# Altium schematic sheet TestPoints.SchDoc
size A4
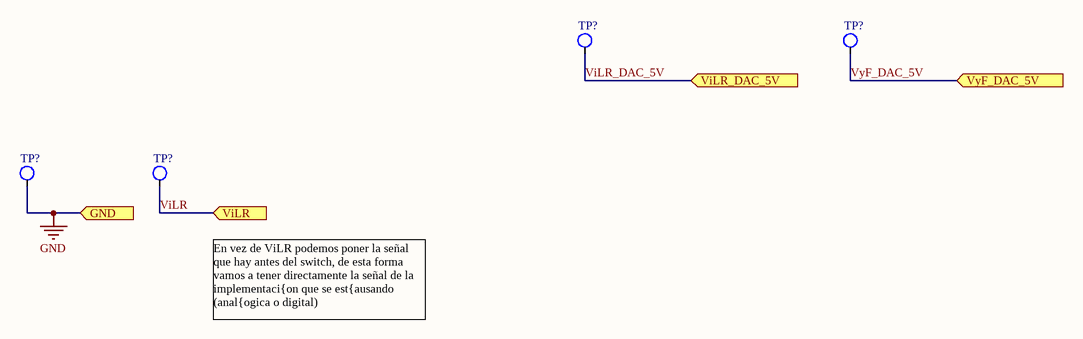
[diagram p0: TestPoints.SchDoc]

## Parts
(Parts that share a designator on the sheet are numbered #1, #2 ... from top to bottom, then left to right.)
TP?#1  Vyr  [TestPoint Keystone 5000 Silver-Red]  (value not drawn)
TP?#2  Vyr  [TestPoint Keystone 5000 Silver-Red]  (value not drawn)
TP?#3  Vyr  [TestPoint Keystone 5000 Silver-Red]  (value not drawn)
TP?#4  Vyr  [TestPoint Keystone 5000 Silver-Red]  (value not drawn)

## Ports
GND (in), ViLR (in), ViLR_DAC_5V (in), VyF_DAC_5V (in)

## Nets
GND: TP?#3.1 ; port GND
ViLR: TP?#4.1 ; port ViLR
ViLR_DAC_5V: TP?#1.1 ; port ViLR_DAC_5V
VyF_DAC_5V: TP?#2.1 ; port VyF_DAC_5V

## Notes on the sheet
- En vez de ViLR podemos poner la señal que hay antes del switch, de esta forma vamos a tener directamente la señal de la implementaci{on que se est{ausando (anal{ogica o digital)

## Library data of the parts
TP?#1-TP?#4 = Tespoint: Test point; Link: https://www.digikey.com/en/products/detail/keystone-electronics/5000/255326